# Altium schematic sheet Power_Protection.SchDoc: Power Protection
size Letter; DrawnBy: Nathan Petersen; Engineer: Nathan Petersen; Organization: Altium Limited; Address1: L3, 12a Rodborough Rd; Address2: Frenchs Forest; Address3: NSW; Address4: Australia 2086; DocumentNumber: 25; Revision: v1.2; SheetNumber: 25; SheetTotal: 26
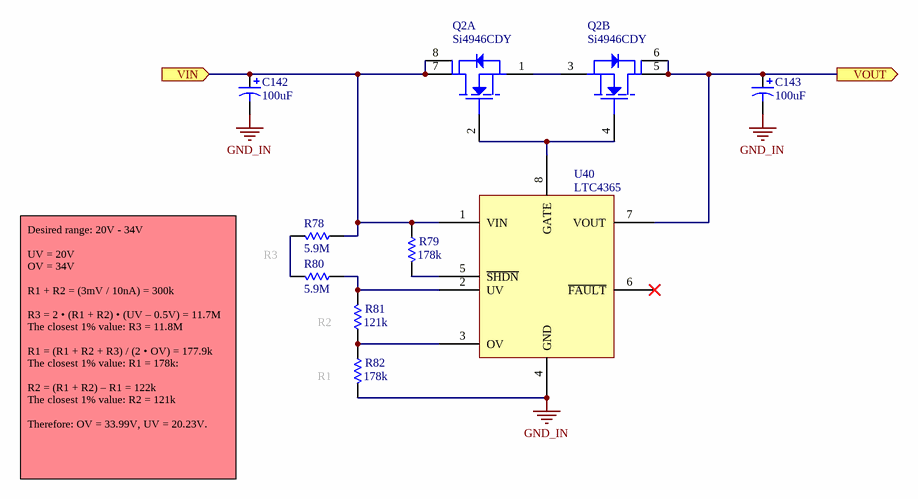
[diagram p0: Power_Protection.SchDoc]

## Parts
C142  value 100uF  [CAP - UWT1V101MCL1GS]  (hidden comment: Cap Pol1)
C143  value 100uF  [CAP - UWT1V101MCL1GS]  (hidden comment: Cap Pol1)
Q2  Si4946CDY  [SOIC127P600X175-8N]  (parts A,B of 2)
R78  value 5.9M  [0603-RES]  (hidden comment: Resistor)
R79  value 178k  [0603-RES]  (hidden comment: Resistor)
R80  value 5.9M  [0603-RES]  (hidden comment: Resistor)
R81  value 121k  [0603-RES]  (hidden comment: Resistor)
R82  value 178k  [0603-RES]  (hidden comment: Resistor)
U40  LTC4365  [TSOP65P280X100-8N]

## Ports
VIN (in), VOUT (out)

## Nets
GND_IN: C142.2 C143.2 R82.2 U40.4(GND)
VIN: C142.1 Q2.7(D1) Q2.8(D1) R78.1 R79.1 U40.1(VIN) ; port VIN
VOUT: C143.1 Q2.5(D2) Q2.6(D2) U40.7(VOUT) ; port VOUT
NetQ2_1: Q2.1(S1) Q2.3(S2)
NetQ2_2: Q2.2(G1) Q2.4(G2) U40.8(GATE)
NetR78_2: R78.2 R80.2
NetR79_2: R79.2 U40.5(~{SHDN})
NetR80_1: R80.1 R81.2 U40.2(UV)
NetR81_1: R81.1 R82.1 U40.3(OV)

Not connected (* = marked no-connect by the designer): U40 6(~{FAULT})*

## Notes on the sheet
- R3
- R2
- (near R82) R1
- Desired range: 20V - 34V
  UV = 20V
  OV = 34V
  R1 + R2 = (3mV / 10nA) = 300k
  R3 = 2 • (R1 + R2) • (UV – 0.5V) = 11.7M
  The closest 1% value: R3 = 11.8M
  R1 = (R1 + R2 + R3) / (2 • OV) = 177.9k
  The closest 1% value: R1 = 178k:
  R2 = (R1 + R2) – R1 = 122k
  The closest 1% value: R2 = 121k
  Therefore: OV = 33.99V, UV = 20.23V.
- Title:
- File:
- Sheet:
- of
- Revision:
- Time:
- Date:
- Engineer:

## Library data of the parts
C142 C143 = Cap Pol1: Polarized Capacitor (Radial); Supplier 1: Digi-Key; Supplier Part Number 1: 493-2203-1-ND
Q2 = SI4946CDY-T1-GE3: MOSFET N-CHAN DUAL 60V SO-8; Supplier 1: Digi-Key; Supplier Part Number 1: SI4946CDY-T1-GE3CT-ND
U40 = LTC4365CTS8#TRMPBF: IC OVERVOLTAGE PROT TSOT23-8; Supplier 1: Digi-Key; Supplier Part Number 1: LTC4365CTS8#TRMPBFCT-ND
R78-R82 = Resistor: Supplier 1: Digi-Key
  R78 R80: Supplier Part Number 1: 541-5.90MHCT-ND
  R79 R82: Supplier Part Number 1: 311-178KHRCT-ND
  R81: Supplier Part Number 1: 311-121KHRCT-ND